# Altium schematic sheet mcu.SchDoc
size A4; Author: Lohith Dayantri; CompanyName: Stethaim; DrawnBy: lohith; SheetNumber: 1; SheetTotal: 1
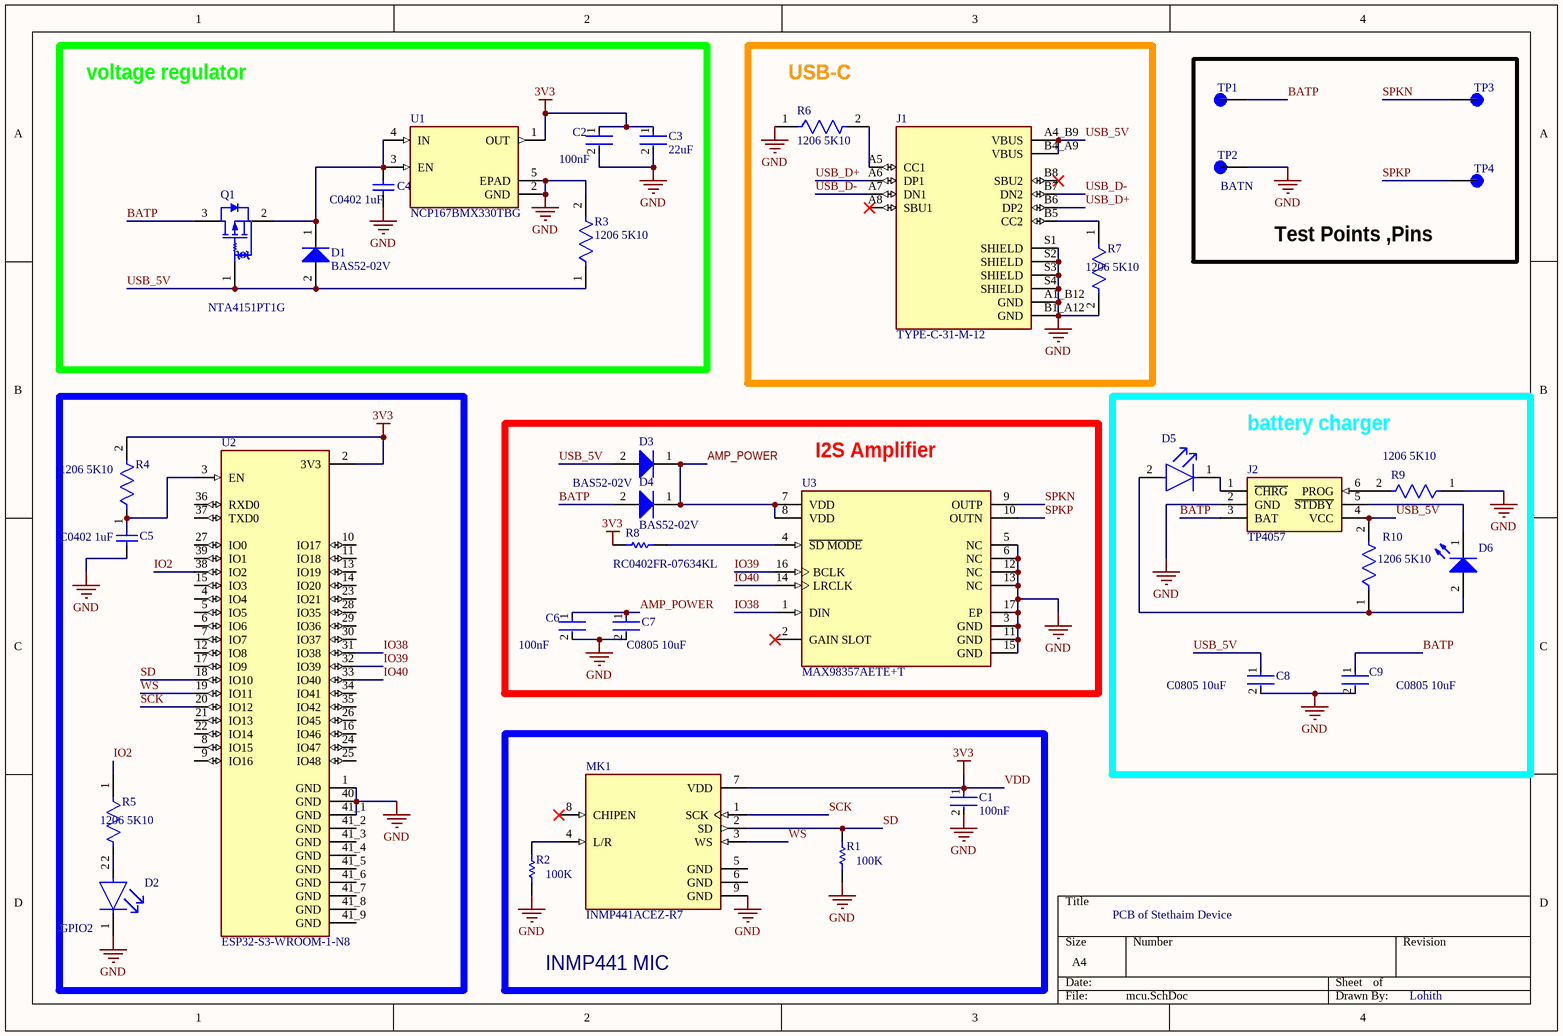
[diagram p0: mcu.SchDoc]

## Parts
C1  100nF  [FP-CGA3E-0_3-0_1-IPC_A]
C2  100nF  [FP-CGA3E-0_3-0_1-IPC_A]
C3  22uF  [FP-CC0603-DC-MFG]
C4  C0402 1uF  [CAPC1005X60X30NL05T10]
C5  C0402 1uF  [CAPC1005X60X30NL05T10]
C6  100nF  [FP-CGA3E-0_3-0_1-IPC_A]
C7  C0805 10uF  [FP-C0805C-DG-MFG]
C8  C0805 10uF  [FP-C0805C-DG-MFG]
C9  C0805 10uF  [FP-C0805C-DG-MFG]
D1  BAS52-02V  [INF-SC79_V]
D2  GPIO2  [FP-LTST-C190KRKT-MFG]
D3  BAS52-02V  [INF-SC79_V]
D4  BAS52-02V  [INF-SC79_V]
D5  PTD3216CGCK  [FP-APTD3216CGCK-MFG]  (value not drawn)
D6  150120BS75000  [WL-SMCW_1206_150120xx75000]  (value not drawn)
J1  TYPE-C-31-M-12  [HRO_TYPE-C-31-M-12]
J2  TP4057  [SOT23-6]
MK1  INMP441ACEZ-R7  [MIC_INMP441ACEZ-R7]
Q1  NTA4151PT1G  [ONSC-SC-75-3-463-01_V]
R1  100K  [RESC3116X65X40ML10T20]
R2  100K  [RESC3116X65X40ML10T20]
R3  1206 5K10  [FP-RMCF1206-IPC_C]
R4  1206 5K10  [FP-RMCF1206-IPC_C]
R5  1206 5K10  [FP-RMCF1206-IPC_C]
R6  1206 5K10  [FP-RMCF1206-IPC_C]
R7  1206 5K10  [FP-RMCF1206-IPC_C]
R8  RC0402FR-07634KL  [RESC1005X40X25LL05T10]
R9  1206 5K10  [FP-RMCF1206-IPC_C]
R10  1206 5K10  [FP-RMCF1206-IPC_C]
TP1  5019  [KEYSTONE_5019]  (value not drawn)
TP2  BATN  [KEYSTONE_5019]
TP3  5019  [KEYSTONE_5019]  (value not drawn)
TP4  5019  [KEYSTONE_5019]  (value not drawn)
U1  NCP167BMX330TBG  [VREG_NCP167BMX330TBG]
U2  ESP32-S3-WROOM-1-N8  [XCVR_ESP32-S3-WROOM-1-N8]
U3  MAX98357AETE+T  [FP-T1633-4-MFG]

## Blocks framed on the sheet
voltage regulator: C2-C4 D1 Q1 R3 U1
USB-C: J1 R6 R7
Test Points ,Pins: TP1-TP4
battery charger: C8 C9 D5 D6 J2 R9 R10
I2S Amplifier: C6 C7 D3 D4 R8 U3
INMP441 MIC: C1 MK1 R1 R2

## Nets
GND: C1.2 C2.2 C3.2 C4.1 C5.1 C6.2 C7.2 C8.2 C9.2 D2.1(C) J1.A1_B12(GND) J1.B1_A12(GND) J1.S1(SHIELD) J1.S2(SHIELD) J1.S3(SHIELD) J1.S4(SHIELD) J2.2(GND) MK1.9(GND) R1.1 R2.1 R3.2 R6.1 R7.2 R9.1 TP2.TP U1.2(GND) U1.5(EPAD) U2.1(GND) U2.40(GND) U2.41_1(GND) U3.3(GND) U3.5(NC) U3.6(NC) U3.11(GND) U3.12(NC) U3.13(NC) U3.15(GND) U3.17(EP)
VDD: C1.1 C2.1 C3.1 MK1.7(VDD) R4.2 R8.1 U1.1(OUT) U2.2(3V3)  [also labelled 3V3]
AMP_POWER: C6.1 C7.1 D3.1(K) D4.1(K) U3.7(VDD) U3.8(VDD)
BATP: C9.1 D4.2(A) J2.3(BAT) Q1.3(D) TP1.TP
IO2: R5.1 U2.38(IO2)
IO38: U2.31(IO38) U3.1(DIN)
IO39: U2.32(IO39) U3.16(BCLK)
IO40: U2.33(IO40) U3.14(LRCLK)
SCK: MK1.1(SCK) U2.20(IO12)
SD: MK1.2(SD) R1.2 U2.18(IO10)
SPKN: TP3.TP U3.9(OUTP)
SPKP: TP4.TP U3.10(OUTN)
USB_5V: C8.1 D1.2(A) D3.2(A) J1.A4_B9(VBUS) J1.B4_A9(VBUS) J2.4(VCC) Q1.1(G) R3.1 R10.2
USB_D+: J1.A6(DP1) J1.B6(DP2)
USB_D-: J1.A7(DN1) J1.B7(DN2)
WS: MK1.3(WS) U2.19(IO11)
NetC4_2: C4.2 D1.1(K) Q1.2(S) U1.3(EN) U1.4(IN)
NetC5_2: C5.2 R4.1 U2.3(EN)
NetD2_2: D2.2(A) R5.2
NetD5_1: D5.1(C) J2.1(~{CHRG})
NetD5_2: D5.2(A) D6.2(A) R10.1
NetD6_1: D6.1(K) J2.5(~{STDBY})
NetJ1_A5: J1.A5(CC1) R6.2
NetJ1_B5: J1.B5(CC2) R7.1
NetJ2_6: J2.6(PROG) R9.2
NetMK1_4: MK1.4(L/R) R2.2
NetR8_2: R8.2 U3.4(~{SD_MODE})

Not connected (* = marked no-connect by the designer): J1 A8(SBU1)* B8(SBU2)*; MK1 5(GND) 6(GND) 8(CHIPEN)*; U2 4(IO4) 5(IO5) 6(IO6) 7(IO7) 8(IO15) 9(IO16) 10(IO17) 11(IO18) 12(IO8) 13(IO19) 14(IO20) 15(IO3) 16(IO46) 17(IO9) 21(IO13) 22(IO14) 23(IO21) 24(IO47) 25(IO48) 26(IO45) 27(IO0) 28(IO35) 29(IO36) 30(IO37) 34(IO41) 35(IO42) 36(RXD0) 37(TXD0) 39(IO1) 41_2(GND) 41_3(GND) 41_4(GND) 41_5(GND) 41_6(GND) 41_7(GND) 41_8(GND) 41_9(GND); U3 2(GAIN_SLOT)*

## Notes on the sheet
- PCB of Stethaim Device
- Lohith

## Library data of the parts
C1 C2 C6 = CMP-2000-07546-2: Cap Ceramic 100nF 50V X7R 10% Pad SMD 0603 +125°C Automotive T/R; Weight: 7.1E-05oz; Composition: Ceramic; Max Operating Temperature: 125°C; Termination: SMD/SMT; Dielectric: X7R; Length: 1.6mm; Package Quantity: 1; REACH SVHC: No SVHC; Lead Free: Lead Free; Case Code (Metric): 1608; Min Operating Temperature: -55°C; Packaging: Tape and Reel; Tolerance: 10%; Voltage Rating: 50V; Case Code (Imperial): 0603; Capacitance: 100nF; Case/Package: 0603; Voltage Rating (DC): 50V; Depth: 0.8mm; Radiation Hardening: No; Ratings: AEC-Q200; Mount: Surface Mount; Voltage: 50V; Thickness: 0.035inch; Width: 0.8mm; Height: 0.8mm
C3 = CMP-2000-06075-2: CAP CER 22UF 6.3V X5R 0603; Tolerance: 20%; Termination: SMD/SMT; Mount: Surface Mount; Depth: 0.8mm; Thickness: 0.035inch; Packaging: Tape and Reel; RoHS Compliant: Yes; Case/Package: 0603; Min Operating Temperature: -55°C; Package Quantity: 4000; Weight: 7.1E-05oz; Max Operating Temperature: 85°C; Voltage Rating (DC): 6.3V; Halogen Free: Halogen Free; Lead Free: Lead Free; Resistor Type: Ceramic; Case Code (Imperial): 0603; Width: 0.031inch; Case Code (Metric): 1608; Voltage Rating: 6.3V; Length: 0.063inch; Capacitance: 22uF; Dielectric: X5R
C4 C5 = CMP-2008-02056-1: Part Number: C0402C105M8PACTU; Manufacturer: Kemet
C7-C9 = CMP-2007-03243-2: CAP CER 10UF 10V X5R 0805; Manufacturer Part Number: C0805C106K8PACTU; Manufacturer: Kemet; 3DS Part Number: 220-00001; Tolerance: 10%; Temperature Coefficient: 15%; Material: Ceramic; Device Class L2: Capacitors; Device Class L1: Passive Components; ComponentLink2URL: https://content.kemet.com/datasheets/KEM_C1006_X5R_SMD.pdf; Height: 1.4mm; Lead Free: Yes; Digikey Description: CAP CER 10UF 10V X5R 0805; Octopart: https://octopart.com/c0805c106k8pactu-kemet-98697; Capacitance: 10uF; Value: 10uF; Temperature Range Low: -55°C; Temperature: -55°C to +85°C; Automotive: No; Mouser Description: CAP CER 10UF 10V X5R 0805; Ipc Land Pattern Name: CAPC200125X125; Temperature Range High: +85°C; Voltage: 10V; RoHS: TRUE; Device Class L3: Ceramic Capacitors; ComponentLink2Description: Datasheet; Voltage Rating: 10V; Package: C0805C-DG; Temperature Characteristic: X5R; Category: Cap
D1 D3 D4 = CMP-1183-00001-1: Silicon Schottky Diode, SC79, Reel, Green; Manufacturer: Infineon; CT (max): 10Â pF; VF (max): 600Â mV; VR (max): 45Â V; IF (max): 750Â mA; Configuration: Single; Green: TRUE; ComponentLink1Description: Manufacturer URL; ComponentLink2URL: http://www.infineon.com/dgdl/bas52series.pdf?folderId=db3a30431f848401011fcbf2ab4c04c4&fileId=db3a30432d9b3066012dbc006764413f; Packing: Reel; ComponentLink1URL: http://www.infineon.com/; PackageDescription: 2-Pin Semiconductor Package, 0.8 x 1.2 mm Body; Mounting Technology: Surface Mount; ComponentLink3URL: http://www.infineon.com/dgdl/SC79-Package_Overview.pdf?folderId=db3a30431936bc4b011951fbddb03b15&fileId=db3a30431936bc4b01195226fe583b41; PartNumber: BAS52-02V; PackageReference: SC79; ComponentLink3Description: Package Specification; Halogen-free: TRUE; ComponentLink2Description: Datasheet
D2 = CMP-1674-00011-2: LED RED CLEAR CHIP SMD; Reverse Voltage: 5V; Viewing Angle: 130°; Power Rating: 75mW; Test Current: 20mA; Number of Elements: 1; Lens Color: Colorless; Wavelength: 639nm; Dominant Wavelength: 631nm; Lens Style: Diffused; Forward Current: 30mA; Forward Voltage: 2.4V; Luminous Intensity: 54mcd; Color: Red; Case Code (Imperial): 0603; Lens Transparency: Clear; Lead Free: Lead Free; Package Quantity: 1; Packaging: Tape and Reel; Max Operating Temperature: 85°C; Number of Pins: 2; Height: 0.8mm; Case/Package: 0603; Number of LEDs: 1; Width: 0.8mm; Case Code (Metric): 1608; Depth: 0.8mm; Mount: Surface Mount; Radiation Hardening: No; Length: 1.6mm; Illumination Color: Red; Power Dissipation: 75mW; Min Operating Temperature: -55°C
D5 = CMP-2000-05792-2: LED GREEN CLEAR 2SMD; Forward Voltage: 2.1V; Forward Current: 20mA; Luminous Intensity: 300mcd; Number of LEDs: 1; Dominant Wavelength: 570nm; Viewing Angle: 50°; Lead Free: Lead Free; Lens Color: Clear; Mount: Surface Mount; Package Quantity: 2000; Height: 1.8mm; Number of Pins: 2; Test Current: 20mA; Case Code (Metric): 3216; Case/Package: 1206; Case Code (Imperial): 1206; Illumination Color: Green; Color: Green; Width: 1.6mm; Packaging: Tape and Reel; Min Operating Temperature: -40°C; Lens Style: Clear; Max Operating Temperature: 85°C; Length: 3.2mm
D6 = CMP-1426-00015-2: NexarPartId: 29717786; Manufacturer Package Identifier: LED_1206; Peak Wavelength: 465nm; Dominant Wavelength: 470nm; Viewing Angle: 140°; Lens Style: Clear, Rectangular; Max Reverse Voltage (DC): 5V; Test Current: 20mA; Forward Voltage: 3.2V; Color: Blue; Forward Current: 100mA; Luminous Intensity: 145mcd; Case Code (Metric): 3216; Case/Package: 1206; Length: 3.2mm; Packaging: Tape and Reel; Case Code (Imperial): 1206; Min Operating Temperature: -40°C; REACH SVHC: Unknown; Height: 680µm; Mount: Surface Mount; Max Operating Temperature: 85°C; RoHS: Compliant; Width: 1.6mm; Wavelength: 470nm
J1 = CMP-010-000000-1: USB Connectors 24 Receptacle 1 8.94*7.3mm RoHS; MF: HRO Electronics Co., Ltd.; Availability: Not in stock; Package: Package; Pin Count: 16; MP: TYPE-C-31-M-12; SnapEDA_Link: https://www.snapeda.com/parts/TYPE-C-31-M-12/HRO+Electronics+Co.%252C+Ltd./view-part/?ref=snap; Price: None; Source: TYPE-C-31-M-12.SchLib; Value: *; Component Type: Standard; Design Item ID: TYPE-C-31-M-12
J2 = TP4057: <b>500mA linear li-ion battery charger</b><p> tp4057 actual charge current to 500ma, dual-lamp indication, reverse battery protection.<br> Alternative to MAX1551 or MAX1555 (not compatible!)<p> Datasheet from TP micro: <br> http://www.tpmicro.com/datasheet/TP4057Ver1.0_preview.pdf <br> http://www.tp-asic.com/te_product_a/2009-05-20/33.chtml; MF: toppower; SnapEDA_Link: https://www.snapeda.com/parts/TP4057/Top+Power/view-part/?ref=snap; Package: None; MP: TP4057; Check_prices: https://www.snapeda.com/parts/TP4057/Top+Power/view-part/?ref=eda; Price: None; Value: *; Availability: Not in stock
MK1 = CMP-006-000000-1: 60Hz ~ 15kHz Digital, IÂ²S Microphone MEMS (Silicon) 1.62V ~ 3.63V Omnidirectional (-26dB Â±3dB @ 94dB SPL) Solder Pads; MF: TDK InvenSense; MP: INMP441ACEZ-R7; SnapEDA_Link: https://www.snapeda.com/parts/INMP441ACEZ-R7/TDK%20InvenSense/view-part/76082/?ref=snap; Availability: Bad; Component Type: Standard; Design Item ID: INMP441ACEZ-R7; Source: INMP441ACEZ-R7.SchLib; Price: None; Value: *; Package: QFN-24 InvenSense; Pin Count: 9
Q1 = CMP-1058-00650-1: Small Signal MOSFET, -20 V, -760 mA, Single P-Channel, Gate Zener, 3-Pin SC75, Pb-Free, Tape and Reel; Manufacturer: On Semiconductor; Crss Typ (pF): 18; ID Max (A): 0.76; Coss Typ (pF): 28; VGS Max (V): 6; Channel Polarity: P Channel; VGS(th) Max (V): 1.2; V(BR)DSS Min (V): 20; Ciss Typ (pF): 156; Packing: Tape and Reel; PackageVersion: Rev. F, 07/2005; ComponentLink1Description: Manufacturer URL; PackageReference: SC-75-3-463-01; ComponentLink3URL: http://www.onsemi.com/pub_link/Collateral/463-01.PDF; Package Type: SC-75-3; PackageDescription: 3-Pin Small Outline Transistor, Body 1.6 x 0.8 mm, Pitch 0.5 mm; PartNumber: NTA4151PT1G; DatasheetVersion: Rev. 7; Mounting Technology: Surface Mount; Configuration: Single; ComponentLink2Description: Datasheet; ComponentLink1URL: http://www.onsemi.com/; ComponentLink2URL: http://www.onsemi.cn/pub_link/Collateral/NTA4151P-D.PDF; RoHS: Pb-Free; ComponentLink3Description: Package Specification
R1 R2 = CMP-2100-03674-1: Chip Resistor, 100 KOhm, +/- 1%, 0.25 W, -55 to 155 degC, 1206 (3216 Metric), RoHS, Tape and Reel; Manufacturer: Yageo; Voltage Rating: 200V; Temperature Coefficient: 100ppm/degreesC; Power Rating: 250mW; Case Code (Metric): 3216; Composition: ThickFilm; Lead Free: LeadFree; Max Operating Temperature: 155degC; Case/Package: 1206; Min Operating Temperature: -55degC; Depth: 1.6mm; RoHSCompliant: true; Datasheet URL: http://www.yageo.com/NewPortal/yageodocoutput?fileName=/pdf/R-Chip/PYu-RC_Group_51_RoHS_L_5.pdf; Datasheet Version: Rev. 5, 10/2016; Package Reference: 1206.0; Packaging: TapeandReel; Resistance: 100KOhm; Manufacturer URL: http://www.yageo.com/; Tolerance: 1%; Height: 0.55mm; REACH SVHC: NoSVHC; Case Code (Imperial): 1206; Length: 3.1mm; Package Description: 2-Pin Surface Mount Device, Body 3.1 x 1.6 mm; Termination: SMD/SMT
R3-R7 R9 R10 = CMP-26527-004028-1: 5.1kΩ ±5% 0.25W 1206 Thick Film Chip Resistor AEC-Q200 compliant; Temperature Coefficient: 200ppm/°C; Power Rating: 250mW; Resistance: 5.1kR; Lead Free: Lead Free; Max Operating Temperature: 155°C; Length: 0.126inch; Construction: Rectangular; Case Code (Imperial): 1206; RoHS Compliant: Yes; Max Power Dissipation: 250mW; Size Code: 1206; Mount: Surface Mount; Case Code (Metric): 3216; Tolerance: 5%; Features: Automotive AEC-Q200; Min Operating Temperature: -55°C; Radiation Hardening: No; Resistor Type: Thick Film; Depth: 1.6mm; Packaging: Tape and Reel; Contact Plating: Tin; Number of Terminations: 2; Height: 0.028inch; Military Standard: Not; Case/Package: 1206; Width: 0.063inch; Series: RMCF
R8 = CMP-2002-07180-1: Manufacturer: Yageo / Phycomp; Part Number: RC0402FR-07634KL
TP1-TP4 = 5019: SMT Test Point- Mininature-1000 pc Reels; MF: Keystone Electronics; Value: *; MP: 5019; Availability: In Stock; Purchase-URL: https://pricing.snapeda.com/search/part/5019/?ref=eda; Package: None; Price: None
U1 = NCP167BMX330TBG: Linear Voltage Regulator IC Positive Fixed 1 Output 700mA 4-XDFN (1x1); MF: onsemi; Package: None; Price: None; Check_prices: https://www.snapeda.com/parts/NCP167BMX330TBG/EMI/view-part/?ref=eda; Value: *; SnapEDA_Link: https://www.snapeda.com/parts/NCP167BMX330TBG/EMI/view-part/?ref=snap; MP: NCP167BMX330TBG; Availability: In Stock; Purchase-URL: https://pricing.snapeda.com/search?q=NCP167BMX330TBG&ref=eda
U2 = CMP-008-000000-2: <a href="https://pricing.snapeda.com/parts/ESP32S3WROOM1N8R8/Espressif%20Systems/view-part?ref=eda">Check availability</a>  <a href="https://pricing.snapeda.com/parts/ESP32-S3-WROOM-1-N8R8/Espressif%20Systems/view-part?ref=eda">Check availability</a>; MF: {'manufacturer': u'Espressif Systems'}; Availability: Unavailable; Pin Count: 49; Price: None; Source: ESP32-S3-WROOM-1-N8.SchLib; Package: None; Design Item ID: ESP32-S3-WROOM-1-N8; Component Type: Standard; Value: *; MP: ESP32-S3-WROOM-1-N8
U3 = CMP-05698-000018-1: IC AMP CLASS D MONO 3.2W 16TQFN; Max Supply Voltage: 5.5V; Max Output Current: 1.6A; Voltage Gain: 15dB; Max Power Dissipation: 1.666W; Min Supply Voltage: 2.5V; Power Supply Rejection Ratio (PSRR): 77dB; Series: -; Contact Plating: Tin; Min Operating Temperature: -40°C; Packaging: Tape and Reel; Max Output Power: 3.2W; Mount: Surface Mount; Number of Pins: 16; RoHS Compliant: Yes; Max Operating Temperature: 85°C; Radiation Hardening: No